# Altium schematic sheet Buck-Schematic.SchDoc
size A0; SheetNumber: 1; SheetTotal: 1
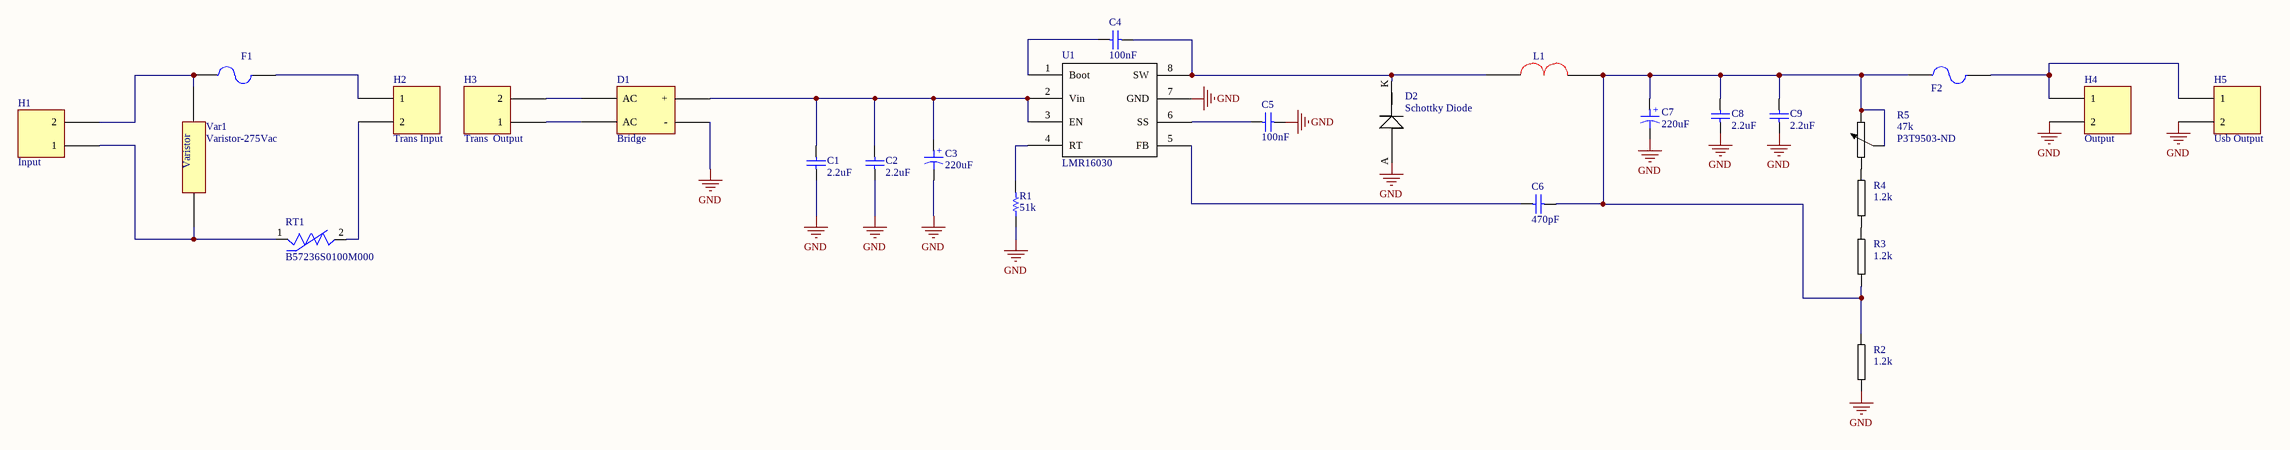
[diagram p0: Buck-Schematic.SchDoc]

## Parts
C1  2.2uF  [CAPC3413X12N]
C2  2.2uF  [CAPC3413X12N]
C3  220uF  [CAP SMD 470uF]
C4  100nF  [CAP0603]
C5  100nF  [CAP0603]
C6  470pF  [CAP0603]
C7  220uF  [CAP SMD 470uF]
C8  2.2uF  [CAPC3413X12N]
C9  2.2uF  [CAPC3413X12N]
D1  Bridge  [PCBComponent_1]
D2  Schottky Diode  [Schottky Diode]
F1  F=1.0 A  [Fuse 5x20 With holder pin]  (value not drawn)
F2  F=1.0 A  [1206 FUSE]  (value not drawn)
H1  Input  [Header]
H2  Trans Input  [Header]
H3  Trans  Output  [Header]
H4  Output  [Header]
H5  Usb Output  [Header]
L1  Inductor  [Inductor]  (value not drawn)
R1  51k  [RESC3413X04N]
R2  1.2k  [0805R-82K]
R3  1.2k  [0805R-82K]
R4  1.2k  [0805R-82K]
R5  47k  Supplier Part Number 1: P3T9503-ND  [pot-pana-evue]
RT1  B57236S0100M000  [THRMRB500W60L1150T500H1600]
U1  LMR16030  [LMR16030]
Var1  Varistor-275Vac  [Varistor - duplicate1]

## Nets
GND: C1.1 C2.1 C3.2 C5.1 C7.2 C8.1 C9.1 D1.1(-) D2.A H4.2 H5.2 R1.1 R2.2 U1.7(GND)
NetC1_2: C1.2 C2.2 C3.1 D1.4(+) U1.2(Vin) U1.3(EN)
NetC4_1: C4.1 D2.K L1.1 U1.8(SW)
NetC4_2: C4.2 U1.1(Boot)
NetC5_2: C5.2 U1.6(SS)
NetC6_1: C6.1 C7.1 C8.2 C9.2 F2.1 L1.2 R2.1 R3.2 R5.2 R5.W
NetC6_2: C6.2 U1.5(FB)
NetD1_2: D1.2(AC) H3.1
NetD1_3: D1.3(AC) H3.2
NetF1_1: F1.1 H1.2 Var1.2
NetF1_2: F1.2 H2.1
NetF2_2: F2.2 H4.1 H5.1
NetH1_1: H1.1 RT1.1 Var1.1
NetH2_2: H2.2 RT1.2
NetR1_2: R1.2 U1.4(RT)
NetR3_1: R3.1 R4.2
NetR4_1: R4.1 R5.1

## Notes on the sheet
- (in symbol Cap ELECTROLITIC TOTAL SIZE) +
- (in symbol Varistor-275Vac) Varistor

## Library data of the parts
C1 C2 C8 C9 = CAP SMD 0805: CAP 0805; Designer: Abbas Basereh; Desc.: CAP SMD 0805; Data: 16-12-2016
C3 C7 = Cap ELECTROLITIC TOTAL SIZE: Cap electrolitic radial; Designer: Abbas Basereh; VALUE: 1uF; Data: 16-12-2016; Part. No: *
C4 C5 = CAP SMD PACKAGE: TOTAL CAPACITOR SMD PACK; Designer: Abbas Basereh; Desc.: CAP SMD TOTAL PACKAGES; Data: 2017-3-10; VALUE: 100nF
C6 = CAP SMD PACKAGE: TOTAL CAPACITOR SMD PACK; Designer: Abbas Basereh; Desc.: CAP SMD TOTAL PACKAGES; VALUE: 100nF; Data: 2017-3-10
F1 = Fuse 5x20 with holdeer pins: Fuses 5x20; Designer: Abbas Basereh; Desc.: fuse with holder pins 5x20; Data: 28-12-2016
F2 = Fuse SMD1206: SMD Fuses 1206; Designer: Abbas Basereh; Desc.: SMD Fuses 1206; Data: 16-12-2016
H1-H5 = Header
R1 = RES 0805 0.125W: RES 0805; Designer: Abbas Basereh; Desc.: RES SMD 0805; Data: 16-12-2016
R2-R4 = 0805R-82: RESISTOR 0805 1/4 WATT THIN FILM; Reel: *
R5 = THPOT-PANA-EVUE-50K: Adjustable resistor; Supplier 1: Digi-Key
RT1 = B57236S0100M000: Thermistor NTC 10 Ohm 20% 2-Pin Radial 2900K Bulk Automotive; MF: EPCOS; SnapEDA_Link: https://www.snapeda.com/parts/B57236S0100M000/EPCOS/view-part/?ref=snap; Availability: In Stock; MP: B57236S0100M000; Purchase-URL: https://pricing.snapeda.com/search/part/B57236S0100M000/?ref=eda; Price: None; Value: *; Check_prices: https://www.snapeda.com/parts/B57236S0100M000/EPCOS/view-part/?ref=eda; Package: None